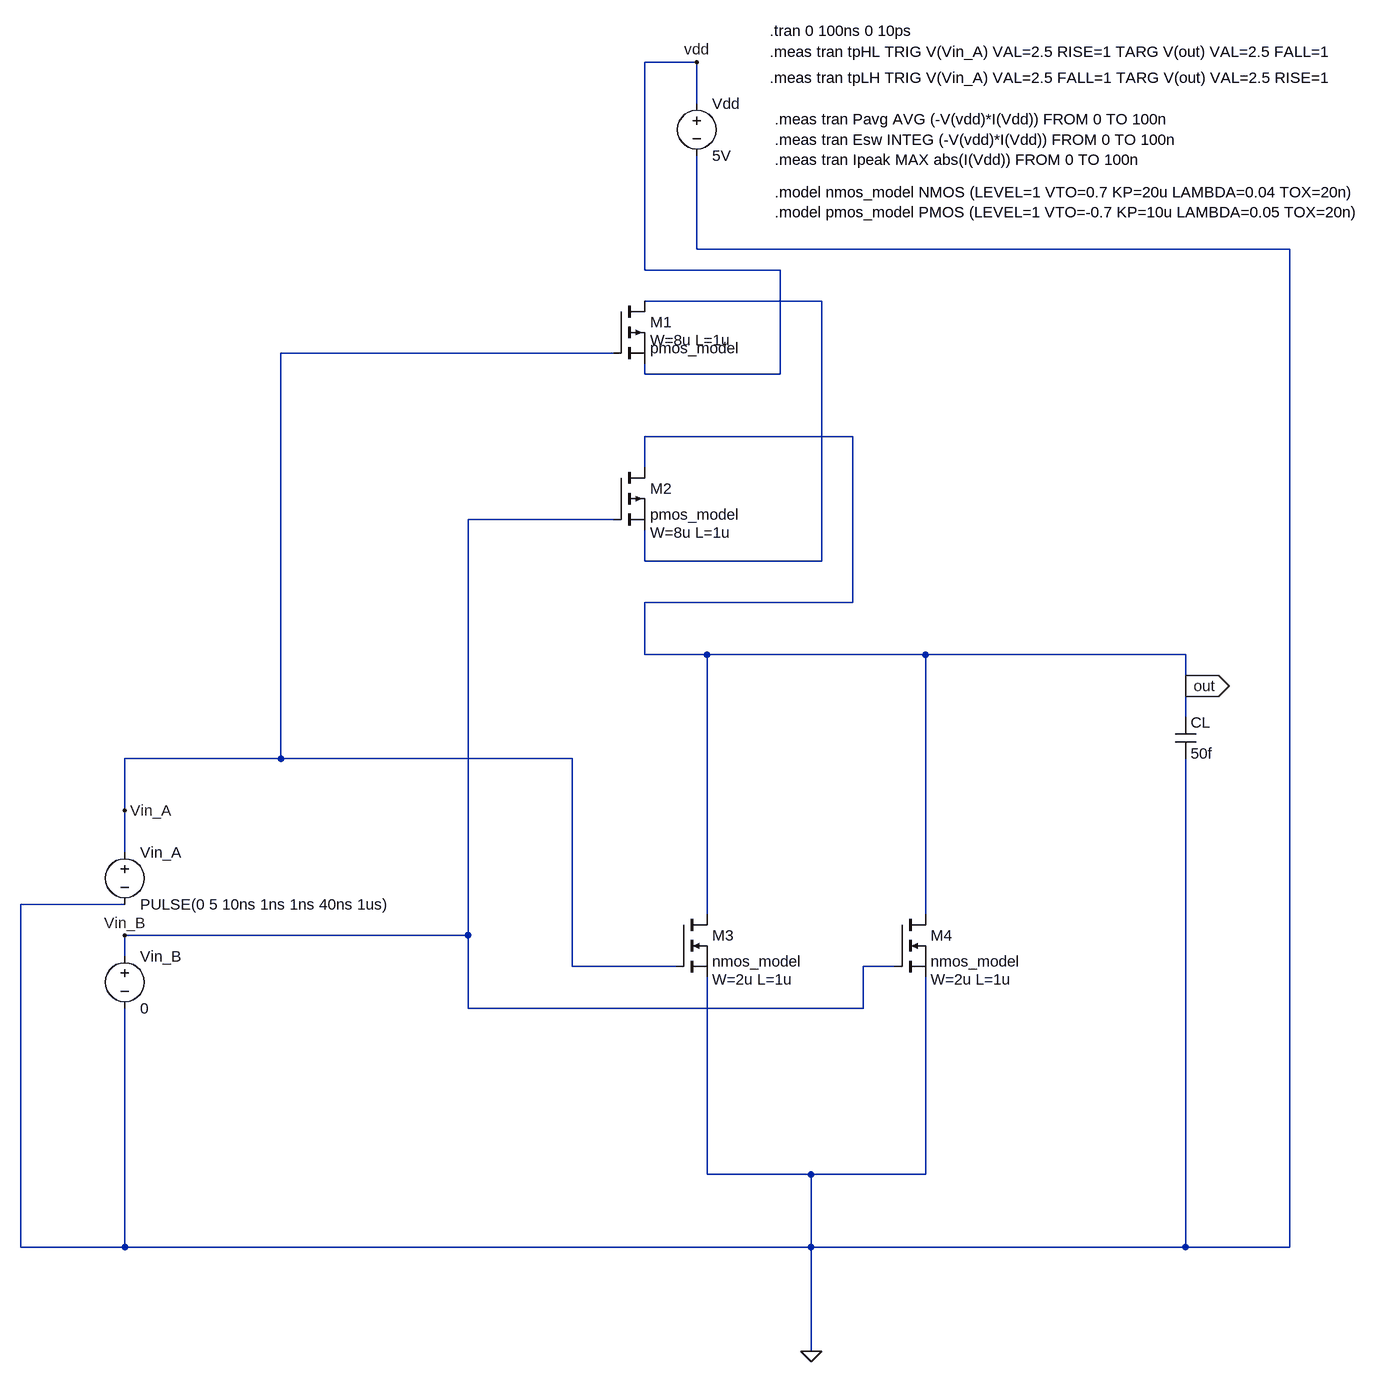
[diagram p0: schematic cmos_nor2.asc]
cmos_nor2.asc, the LTspice schematic file:
Version 4.1
SHEET 1 3224 1588
WIRE 448 -416 368 -416
WIRE 448 -352 448 -416
WIRE 448 -128 448 -272
WIRE 1360 -128 448 -128
WIRE 368 -96 368 -416
WIRE 576 -96 368 -96
WIRE 640 -48 368 -48
WIRE 320 32 -192 32
WIRE 368 64 368 48
WIRE 576 64 576 -96
WIRE 576 64 368 64
WIRE 688 160 368 160
WIRE 368 208 368 160
WIRE 320 288 96 288
WIRE 368 352 368 304
WIRE 640 352 640 -48
WIRE 640 352 368 352
WIRE 688 416 688 160
WIRE 688 416 368 416
WIRE 368 496 368 416
WIRE 464 496 368 496
WIRE 800 496 464 496
WIRE 1200 496 800 496
WIRE 1200 544 1200 496
WIRE 1200 592 1200 544
WIRE -192 656 -192 32
WIRE -192 656 -432 656
WIRE 256 656 -192 656
WIRE -432 736 -432 656
WIRE -432 800 -432 736
WIRE -432 880 -592 880
WIRE 464 896 464 496
WIRE 800 896 800 496
WIRE 96 928 96 288
WIRE 96 928 -432 928
WIRE -432 960 -432 928
WIRE 256 976 256 656
WIRE 416 976 256 976
WIRE 752 976 704 976
WIRE 96 1040 96 928
WIRE 704 1040 704 976
WIRE 704 1040 96 1040
WIRE 464 1296 464 992
WIRE 624 1296 464 1296
WIRE 800 1296 800 992
WIRE 800 1296 624 1296
WIRE -592 1408 -592 880
WIRE -432 1408 -432 1040
WIRE -432 1408 -592 1408
WIRE 624 1408 624 1296
WIRE 624 1408 -432 1408
WIRE 1200 1408 1200 656
WIRE 1200 1408 624 1408
WIRE 1360 1408 1360 -128
WIRE 1360 1408 1200 1408
WIRE 624 1568 624 1408
FLAG 624 1568 0
FLAG 448 -416 vdd
FLAG -432 736 Vin_A
FLAG -432 928 Vin_B
FLAG 1200 544 out
IOPIN 1200 544 Out
SYMBOL voltage 448 -368 R0
WINDOW 123 0 0 Left 0
WINDOW 39 0 0 Left 0
SYMATTR InstName Vdd
SYMATTR Value 5V
SYMBOL voltage -432 784 R0
WINDOW 123 0 0 Left 0
WINDOW 39 0 0 Left 0
SYMATTR InstName Vin_A
SYMATTR Value PULSE(0 5 10ns 1ns 1ns 40ns 1us)
SYMBOL voltage -432 944 R0
WINDOW 123 0 0 Left 0
WINDOW 39 0 0 Left 0
SYMATTR InstName Vin_B
SYMATTR Value 0
SYMBOL cap 1184 592 R0
SYMATTR InstName CL
SYMATTR Value 50f
SYMBOL pmos 320 -48 R0
WINDOW 39 56 60 Left 2
SYMATTR SpiceLine W=8u L=1u
SYMATTR InstName M1
SYMATTR Value pmos_model
SYMBOL pmos 320 208 R0
WINDOW 39 56 100 Left 2
SYMATTR SpiceLine W=8u L=1u
SYMATTR InstName M2
SYMATTR Value pmos_model
SYMBOL nmos 416 896 R0
WINDOW 39 56 100 Left 2
SYMATTR SpiceLine W=2u L=1u
SYMATTR InstName M3
SYMATTR Value nmos_model
SYMBOL nmos 752 896 R0
WINDOW 39 56 100 Left 2
SYMATTR SpiceLine W=2u L=1u
SYMATTR InstName M4
SYMATTR Value nmos_model
TEXT 560 -464 Left 2 !.tran 0 100ns 0 10ps
TEXT 560 -432 Left 2 !.meas tran tpHL TRIG V(Vin_A) VAL=2.5 RISE=1 TARG V(out) VAL=2.5 FALL=1
TEXT 560 -392 Left 2 !.meas tran tpLH TRIG V(Vin_A) VAL=2.5 FALL=1 TARG V(out) VAL=2.5 RISE=1
TEXT 568 -328 Left 2 !.meas tran Pavg AVG (-V(vdd)*I(Vdd)) FROM 0 TO 100n\n.meas tran Esw INTEG (-V(vdd)*I(Vdd)) FROM 0 TO 100n\n.meas tran Ipeak MAX abs(I(Vdd)) FROM 0 TO 100n
TEXT 568 -216 Left 2 !.model nmos_model NMOS (LEVEL=1 VTO=0.7 KP=20u LAMBDA=0.04 TOX=20n)\n.model pmos_model PMOS (LEVEL=1 VTO=-0.7 KP=10u LAMBDA=0.05 TOX=20n)

The netlist it stands for:
* cmos_nor2.asc
Vdd vdd 0 5V
Vin_A Vin_A 0 PULSE(0 5 10ns 1ns 1ns 40ns 1us)
Vin_B Vin_B 0 0
CL out 0 50f
M1 N001 Vin_A vdd vdd pmos_model W=8u L=1u
M2 out Vin_B N001 N001 pmos_model W=8u L=1u
M3 out Vin_A 0 0 nmos_model W=2u L=1u
M4 out Vin_B 0 0 nmos_model W=2u L=1u
.model NMOS NMOS
.model PMOS PMOS
.lib standard.mos
.tran 0 100ns 0 10ps
.meas tran tpHL TRIG V(Vin_A) VAL=2.5 RISE=1 TARG V(out) VAL=2.5 FALL=1
.meas tran tpLH TRIG V(Vin_A) VAL=2.5 FALL=1 TARG V(out) VAL=2.5 RISE=1
.meas tran Pavg AVG (-V(vdd)*I(Vdd)) FROM 0 TO 100n
.meas tran Esw INTEG (-V(vdd)*I(Vdd)) FROM 0 TO 100n
.meas tran Ipeak MAX abs(I(Vdd)) FROM 0 TO 100n
.model nmos_model NMOS (LEVEL=1 VTO=0.7 KP=20u LAMBDA=0.04 TOX=20n)
.model pmos_model PMOS (LEVEL=1 VTO=-0.7 KP=10u LAMBDA=0.05 TOX=20n)
.backanno
.end